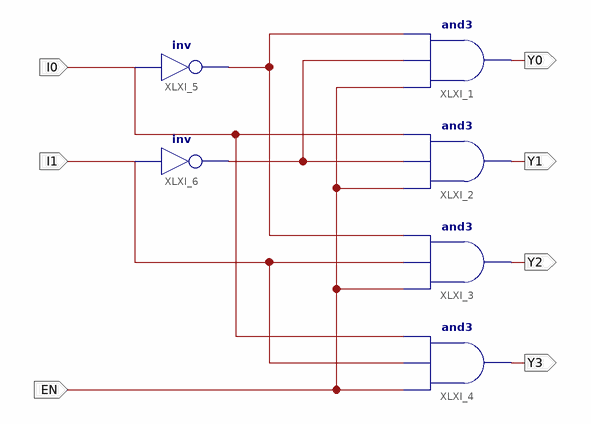
[diagram p0: schematic sheet 1]
// Xilinx ISE schematic Decoder_2_to_4.sch (spartan3e) as structural Verilog: 6 symbols, 7 ports
module Decoder_2_to_4 (
  input  EN,
  input  I0,
  input  I1,
  output Y0,
  output Y1,
  output Y2,
  output Y3
);

  wire XLXN_5, XLXN_7;

  and XLXI_1 (Y0, EN, XLXN_7, XLXN_5);
  and XLXI_2 (Y1, EN, XLXN_7, I0);
  and XLXI_3 (Y2, EN, I1, XLXN_5);
  and XLXI_4 (Y3, EN, I1, I0);
  not XLXI_5 (XLXN_5, I0);
  not XLXI_6 (XLXN_7, I1);
endmodule
